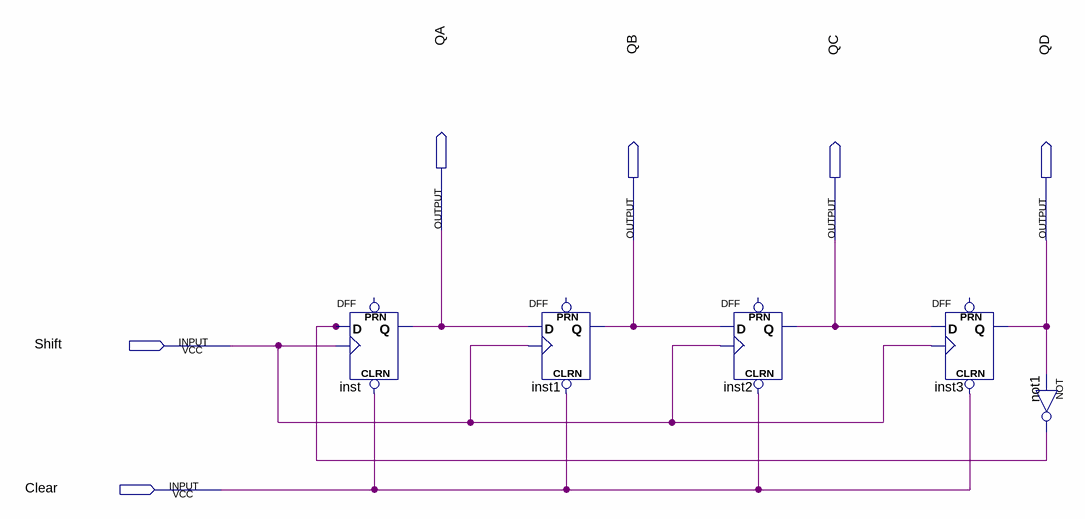
[diagram p0: schematic sheet]
// Quartus schematic FourBitTwistedRingCounter.bdf as structural Verilog: 5 symbols, 6 pins
module FourBitTwistedRingCounter (
  input  Shift,
  input  Clear,
  output QA,
  output QB,
  output QC,
  output QD
);

  wire not1_out;

  DFF inst (.CLRN(Clear), .CLK(Shift), .D(not1_out), .Q(QA));  // open: PRN
  DFF inst1 (.CLRN(Clear), .CLK(Shift), .D(QA), .Q(QB));  // open: PRN
  DFF inst2 (.CLRN(Clear), .CLK(Shift), .D(QB), .Q(QC));  // open: PRN
  DFF inst3 (.CLRN(Clear), .CLK(Shift), .D(QC), .Q(QD));  // open: PRN
  not not1 (not1_out, QD);
endmodule
